# Altium schematic sheet Sheet1.SchDoc
size A4; SheetNumber: 1; SheetTotal: 3
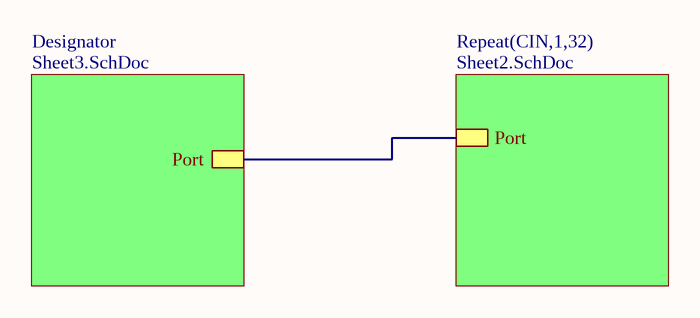
[diagram p0: Sheet1.SchDoc]

## Sub-sheets
Designator = Sheet3.SchDoc: Port
Repeat(CIN,1,32) = Sheet2.SchDoc: Port

## Nets
(unnamed): sheet Repeat(CIN,1,32)/Port, sheet Designator/Port